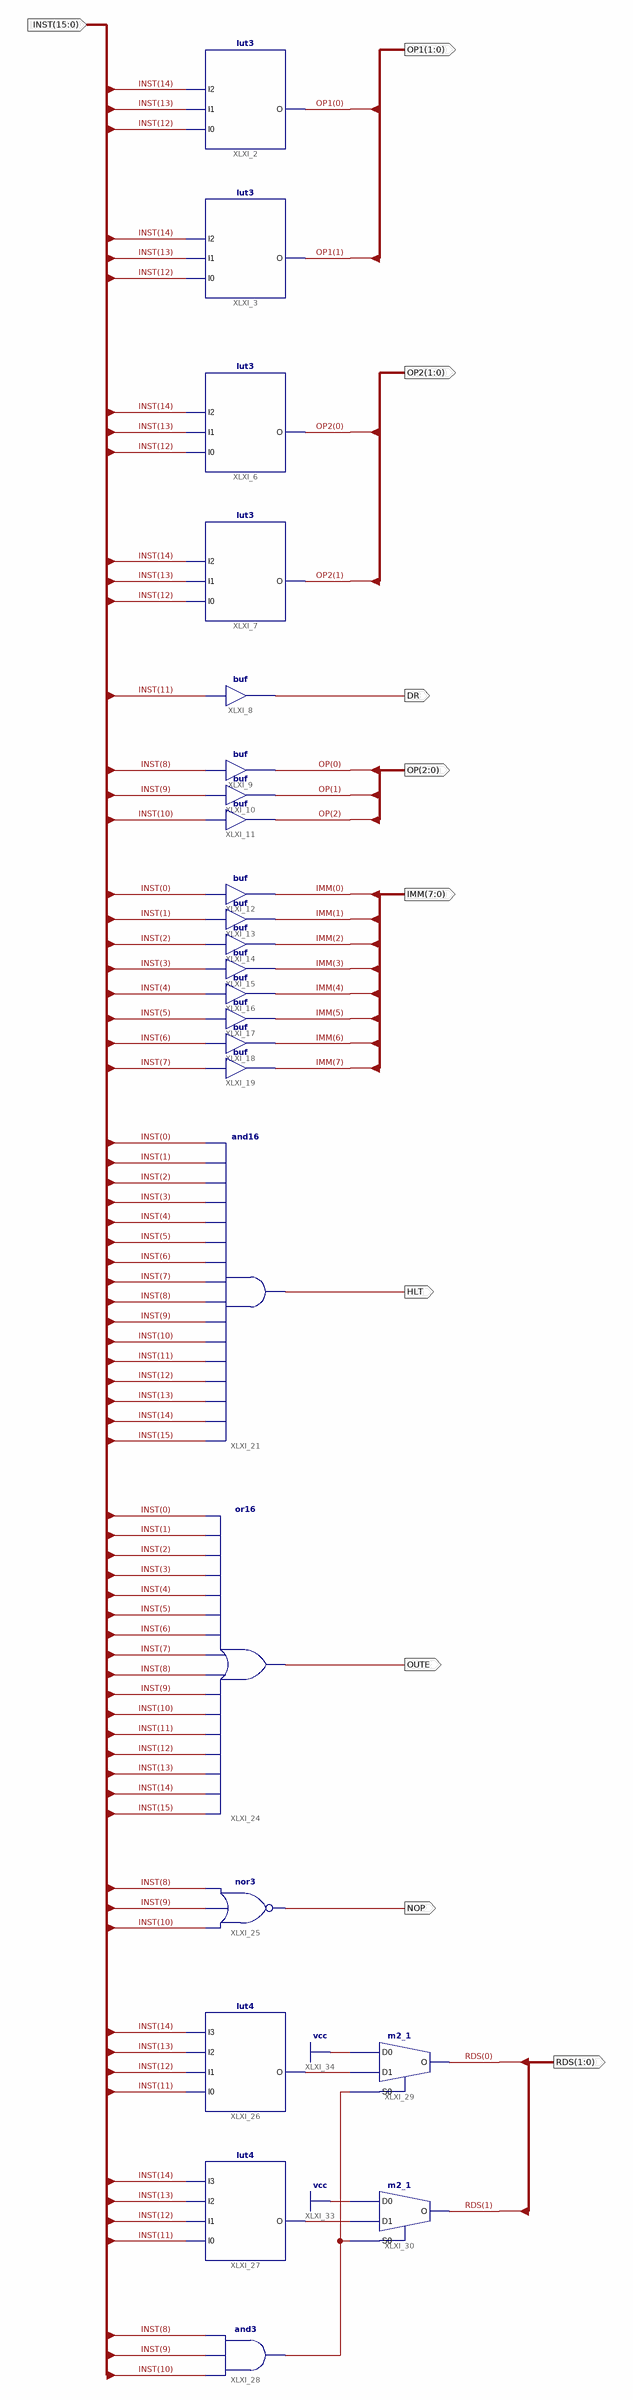
[diagram p0: schematic sheet 1]
// Xilinx ISE schematic inst_decode.sch (spartan6) as structural Verilog: 24 symbols, 10 ports
module inst_decode (
  input  [15:0] INST,
  output [1:0] OP1,
  output [1:0] OP2,
  output DR,
  output [2:0] OP,
  output [7:0] IMM,
  output HLT,
  output OUTE,
  output NOP,
  output [1:0] RDS
);

  wire XLXN_21, XLXN_22, XLXN_23;

  lut3 #(.INIT("D2")) XLXI_2 (.I0(INST[12]), .I1(INST[13]), .I2(INST[14]), .O(OP1[0]));
  lut3 #(.INIT("E8")) XLXI_3 (.I0(INST[12]), .I1(INST[13]), .I2(INST[14]), .O(OP1[1]));
  lut3 #(.INIT("E1")) XLXI_6 (.I0(INST[12]), .I1(INST[13]), .I2(INST[14]), .O(OP2[0]));
  lut3 #(.INIT("D4")) XLXI_7 (.I0(INST[12]), .I1(INST[13]), .I2(INST[14]), .O(OP2[1]));
  buf XLXI_8 (DR, INST[11]);
  buf XLXI_9 (OP[0], INST[8]);
  buf XLXI_10 (OP[1], INST[9]);
  buf XLXI_11 (OP[2], INST[10]);
  buf XLXI_12 (IMM[0], INST[0]);
  buf XLXI_13 (IMM[1], INST[1]);
  buf XLXI_14 (IMM[2], INST[2]);
  buf XLXI_15 (IMM[3], INST[3]);
  buf XLXI_16 (IMM[4], INST[4]);
  buf XLXI_17 (IMM[5], INST[5]);
  buf XLXI_18 (IMM[6], INST[6]);
  buf XLXI_19 (IMM[7], INST[7]);
  and XLXI_21 (HLT, INST[15], INST[14], INST[13], INST[12], INST[11], INST[10], INST[9], INST[8], INST[7], INST[6], INST[5], INST[4], INST[3], INST[2], INST[1], INST[0]);
  or XLXI_24 (OUTE, INST[15], INST[14], INST[13], INST[12], INST[11], INST[10], INST[9], INST[8], INST[7], INST[6], INST[5], INST[4], INST[3], INST[2], INST[1], INST[0]);
  nor XLXI_25 (NOP, INST[10], INST[9], INST[8]);
  lut4 #(.INIT("0005")) XLXI_26 (.I0(INST[11]), .I1(INST[12]), .I2(INST[13]), .I3(INST[14]), .O(XLXN_23));
  lut4 #(.INIT("FFF0")) XLXI_27 (.I0(INST[11]), .I1(INST[12]), .I2(INST[13]), .I3(INST[14]), .O(XLXN_22));
  and XLXI_28 (XLXN_21, INST[10], INST[9], INST[8]);
  m2_1 XLXI_29 (.D0(1'b1), .D1(XLXN_23), .S0(XLXN_21), .O(RDS[0]));
  m2_1 XLXI_30 (.D0(1'b1), .D1(XLXN_22), .S0(XLXN_21), .O(RDS[1]));
endmodule
